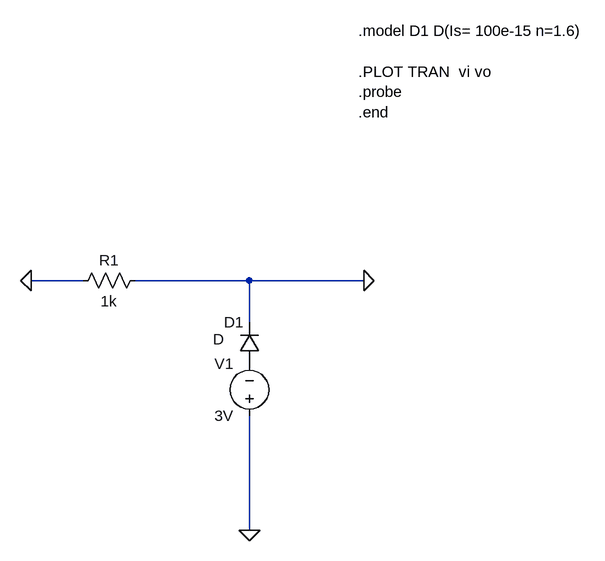
[diagram p0: schematic 3.7D.asc]
3.7D.asc, the LTspice schematic file:
Version 4
SHEET 1 880 820
WIRE -304 416 -384 416
WIRE -48 416 -224 416
WIRE 128 416 -48 416
WIRE -48 480 -48 416
WIRE -48 800 -48 624
FLAG -48 800 0
FLAG 128 416 0
FLAG -384 416 0
SYMBOL res -208 400 R90
WINDOW 0 0 56 VBottom 2
WINDOW 3 32 56 VTop 2
SYMATTR InstName R1
SYMATTR Value 1k
SYMBOL diode -32 544 R180
WINDOW 0 24 64 Left 2
WINDOW 3 55 38 Left 2
SYMATTR InstName D1
SYMBOL voltage -48 640 R180
WINDOW 0 24 96 Left 2
WINDOW 3 24 16 Left 2
WINDOW 123 0 0 Left 2
WINDOW 39 0 0 Left 2
SYMATTR InstName V1
SYMATTR Value 3V
TEXT 120 32 Left 2 !.model D1 D(Is= 100e-15 n=1.6)\n \n.PLOT TRAN  vi vo\n.probe\n.end

The netlist it stands for:
* 3.7D.asc
R1 0 0 1k
D1 P001 0 D
V1 0 P001 3V
.model D D
.lib standard.dio
.model D1 D(Is= 100e-15 n=1.6)
.PLOT TRAN  vi vo
.probe
.end
.backanno
.end